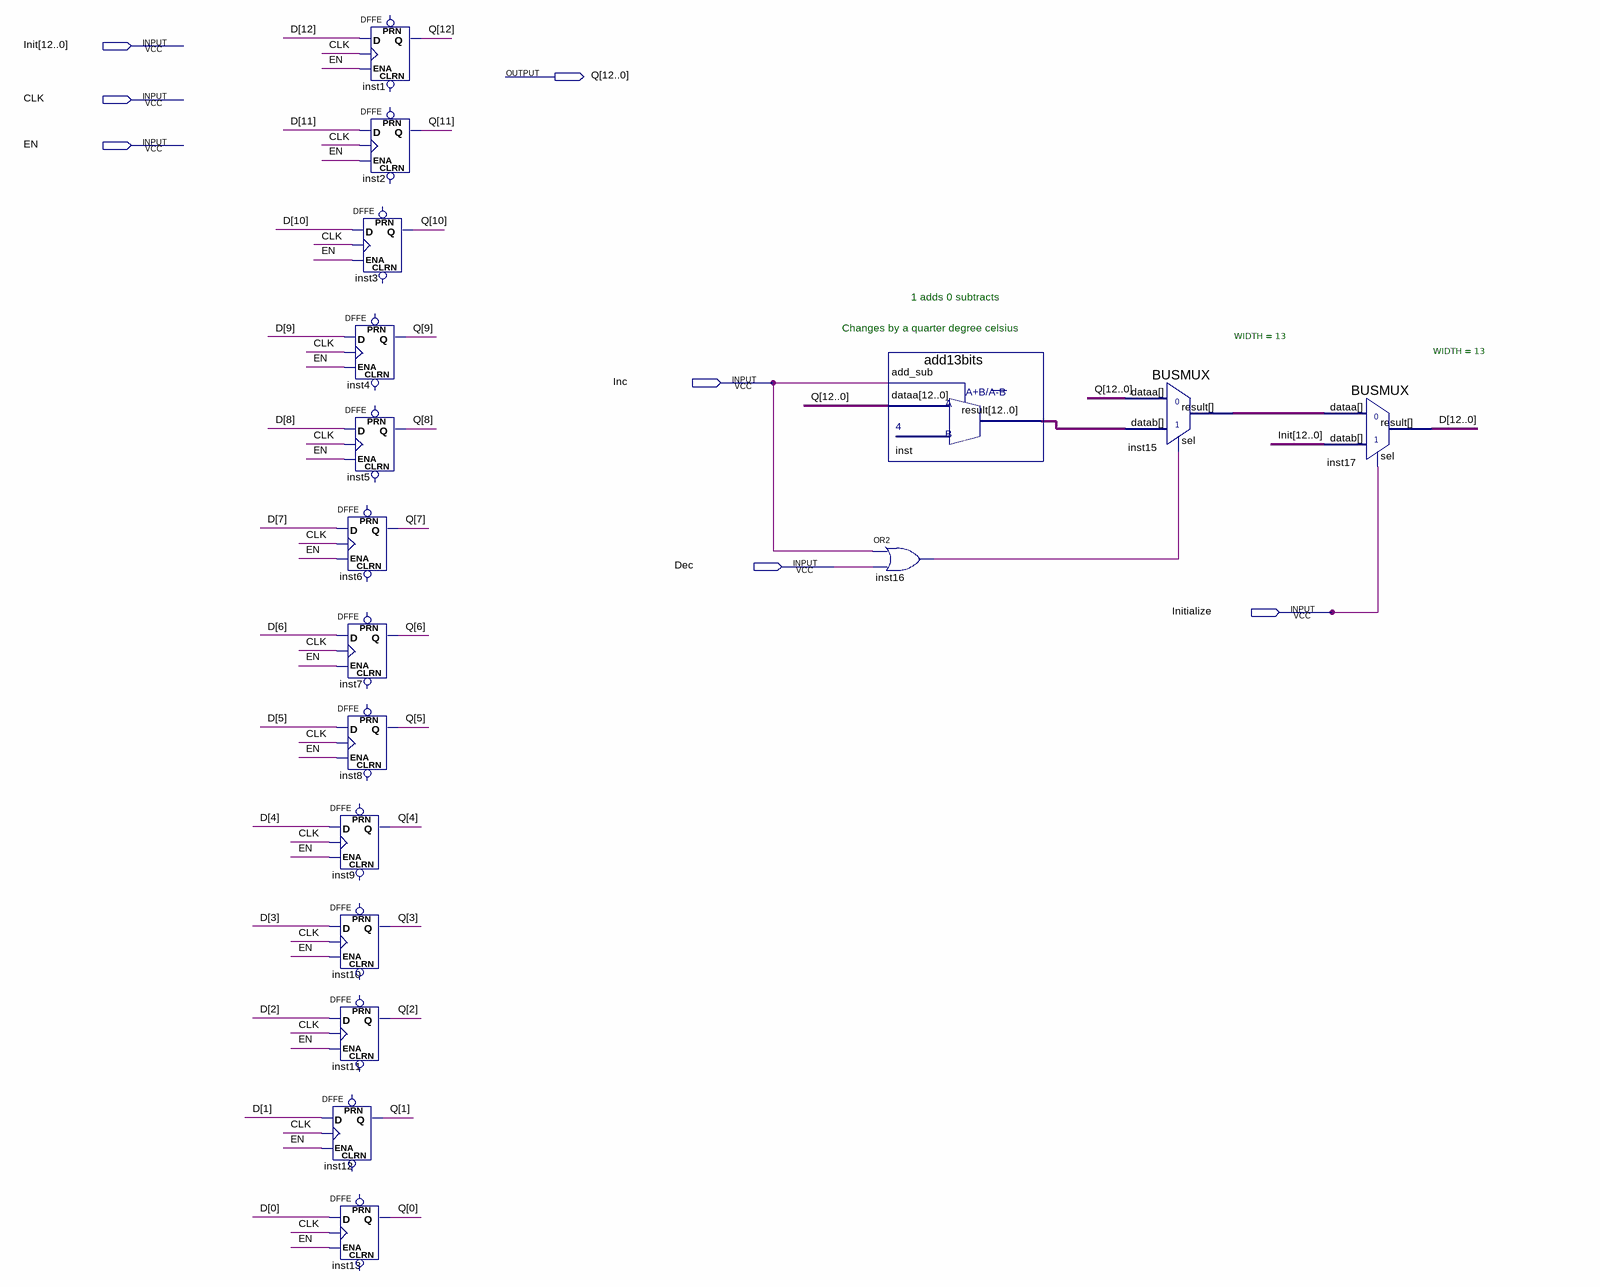
[diagram p0: schematic sheet]
// Quartus schematic SetpointRegister.bdf as structural Verilog: 17 symbols, 7 pins
module SetpointRegister (
  input  [12:0] Init,
  input  CLK,
  input  EN,
  input  Inc,
  input  Dec,
  input  Initialize,
  output [12:0] Q
);

  wire inst16_out;
  wire [12:0] D, inst15_result, inst_result;

  DFFE inst1 (.D(D[12]), .CLK(CLK), .ENA(EN), .Q(Q[12]));  // open: PRN, CLRN
  DFFE inst2 (.D(D[11]), .CLK(CLK), .ENA(EN), .Q(Q[11]));  // open: PRN, CLRN
  DFFE inst3 (.D(D[10]), .CLK(CLK), .ENA(EN), .Q(Q[10]));  // open: PRN, CLRN
  DFFE inst4 (.D(D[9]), .CLK(CLK), .ENA(EN), .Q(Q[9]));  // open: PRN, CLRN
  DFFE inst5 (.D(D[8]), .CLK(CLK), .ENA(EN), .Q(Q[8]));  // open: PRN, CLRN
  DFFE inst6 (.D(D[7]), .CLK(CLK), .ENA(EN), .Q(Q[7]));  // open: PRN, CLRN
  DFFE inst7 (.D(D[6]), .CLK(CLK), .ENA(EN), .Q(Q[6]));  // open: PRN, CLRN
  DFFE inst8 (.D(D[5]), .CLK(CLK), .ENA(EN), .Q(Q[5]));  // open: PRN, CLRN
  DFFE inst9 (.D(D[4]), .CLK(CLK), .ENA(EN), .Q(Q[4]));  // open: PRN, CLRN
  DFFE inst10 (.D(D[3]), .CLK(CLK), .ENA(EN), .Q(Q[3]));  // open: PRN, CLRN
  DFFE inst11 (.D(D[2]), .CLK(CLK), .ENA(EN), .Q(Q[2]));  // open: PRN, CLRN
  DFFE inst12 (.D(D[1]), .CLK(CLK), .ENA(EN), .Q(Q[1]));  // open: PRN, CLRN
  DFFE inst13 (.D(D[0]), .CLK(CLK), .ENA(EN), .Q(Q[0]));  // open: PRN, CLRN
  add13bits inst (.add_sub(Inc), .dataa(Q), .result(inst_result));
  or inst16 (inst16_out, Inc, Dec);
  BUSMUX #(.WIDTH(13)) inst15 (.datab(inst_result), .sel(inst16_out), .dataa(Q), .result(inst15_result));
  BUSMUX #(.WIDTH(13)) inst17 (.datab(Init), .sel(Initialize), .dataa(inst15_result), .result(D));

  // Notes on the sheet:
  //   1 adds 0 subtracts
  //   Changes by a quarter degree celsius
endmodule
